# EAGLE design mojoafe (EAGLE 6.4)
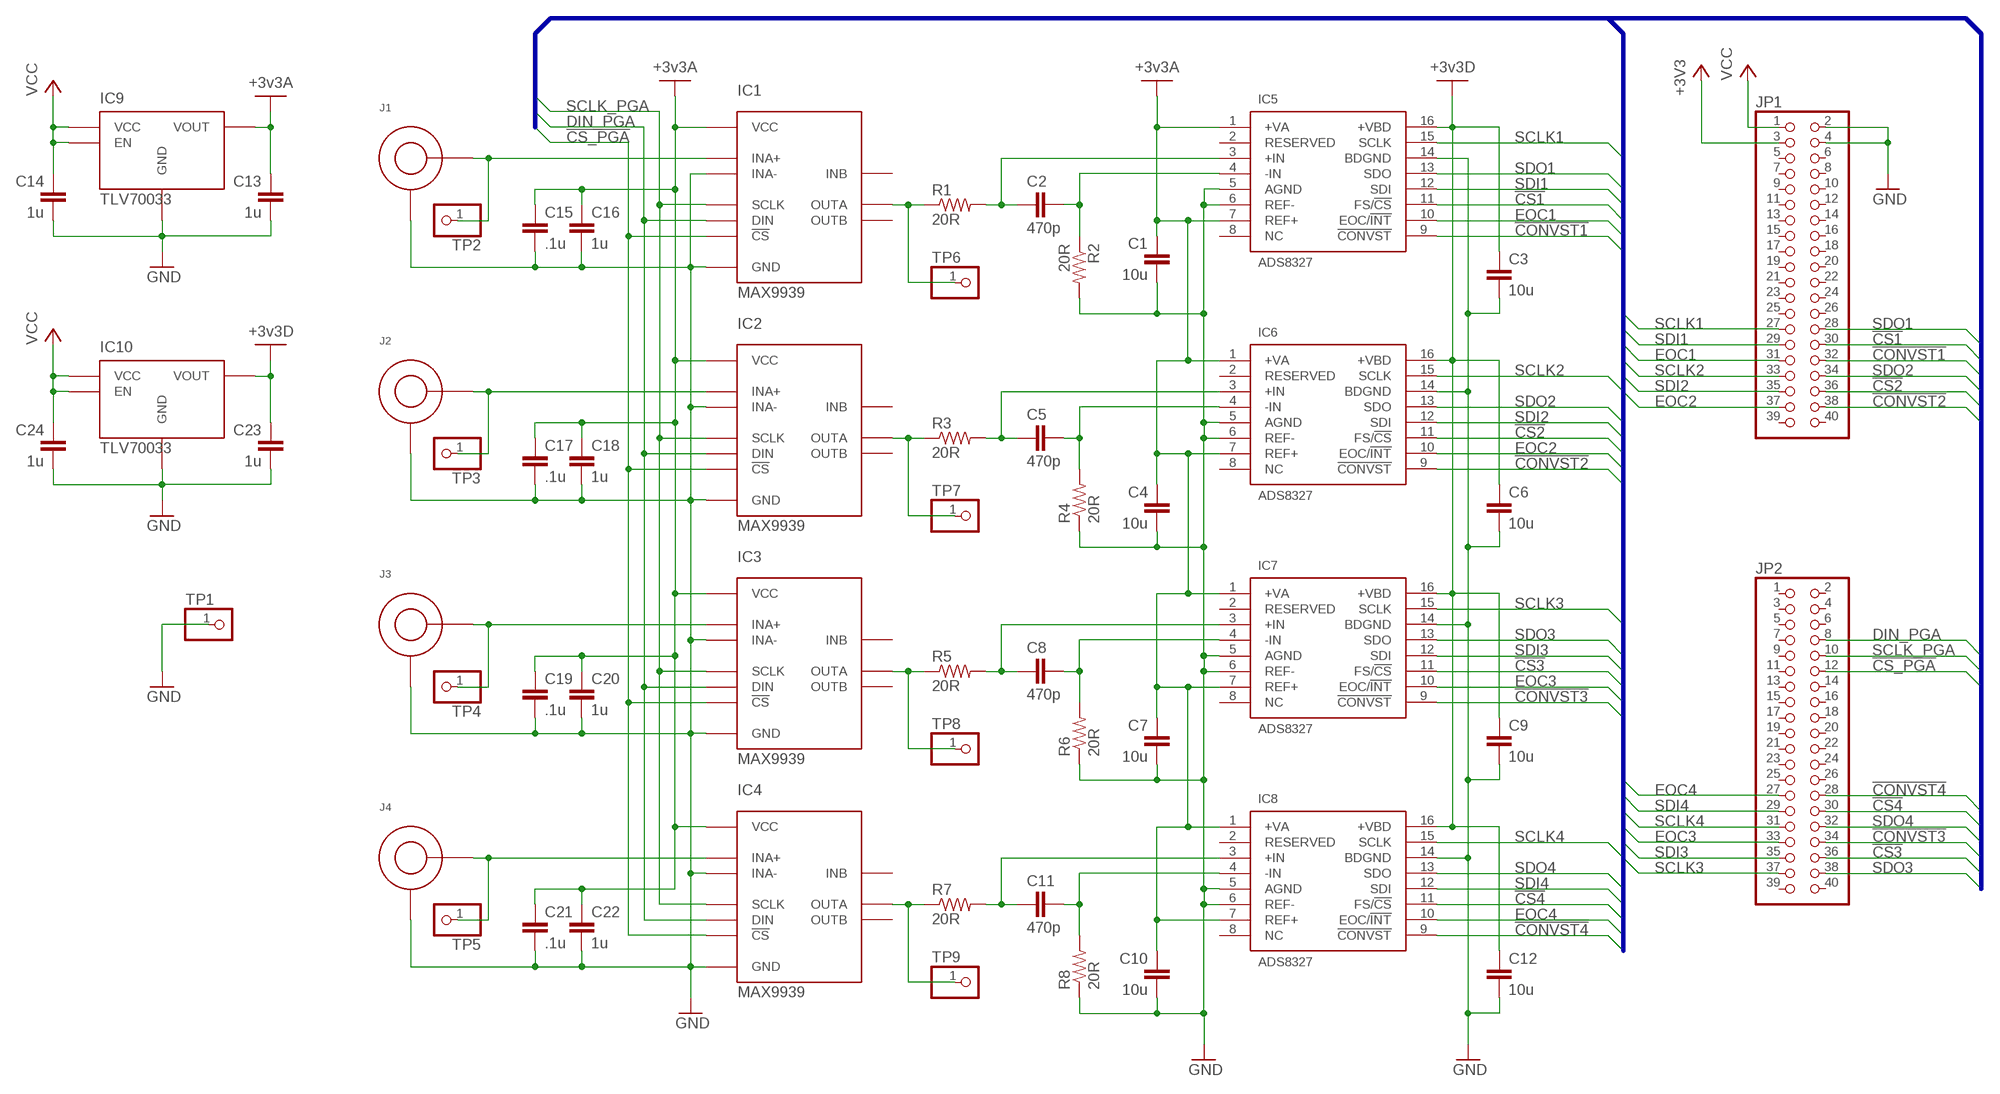
[diagram p0: schematic, sheet 1]

## Parts
C1  10u  C-EUC0603K  [C0603K]
C2  470p  C-EUC0603K  [C0603K]
C3  10u  C-EUC0603K  [C0603K]
C4  10u  C-EUC0603K  [C0603K]
C5  470p  C-EUC0603K  [C0603K]
C6  10u  C-EUC0603K  [C0603K]
C7  10u  C-EUC0603K  [C0603K]
C8  470p  C-EUC0603K  [C0603K]
C9  10u  C-EUC0603K  [C0603K]
C10  10u  C-EUC0603K  [C0603K]
C11  470p  C-EUC0603K  [C0603K]
C12  10u  C-EUC0603K  [C0603K]
C13  1u  C-EUC0603K  [C0603K]
C14  1u  C-EUC0603K  [C0603K]
C15  .1u  C-EUC0603K  [C0603K]
C16  1u  C-EUC0603K  [C0603K]
C17  .1u  C-EUC0603K  [C0603K]
C18  1u  C-EUC0603K  [C0603K]
C19  .1u  C-EUC0603K  [C0603K]
C20  1u  C-EUC0603K  [C0603K]
C21  .1u  C-EUC0603K  [C0603K]
C22  1u  C-EUC0603K  [C0603K]
C23  1u  C-EUC0603K  [C0603K]
C24  1u  C-EUC0603K  [C0603K]
IC1  MAX9939  [UMAX10]
IC2  MAX9939  [UMAX10]
IC3  MAX9939  [UMAX10]
IC4  MAX9939  [UMAX10]
IC5  ADS8327  [TSSOP16]
IC6  ADS8327  [TSSOP16]
IC7  ADS8327  [TSSOP16]
IC8  ADS8327  [TSSOP16]
IC9  TLV70033  [SOT5]
IC10  TLV70033  [SOT5]
J1  SMB50R  [SMB50R]
J2  SMB50R  [SMB50R]
J3  SMB50R  [SMB50R]
J4  SMB50R  [SMB50R]
JP1  PINHD-2X20  [2X20]
JP2  PINHD-2X20  [2X20]
R1  20R  R-US_R0603  [R0603]
R2  20R  R-US_R0603  [R0603]
R3  20R  R-US_R0603  [R0603]
R4  20R  R-US_R0603  [R0603]
R5  20R  R-US_R0603  [R0603]
R6  20R  R-US_R0603  [R0603]
R7  20R  R-US_R0603  [R0603]
R8  20R  R-US_R0603  [R0603]
TP1  PINHD-1X1  [1X01]
TP2  PINHD-1X1  [1X01]
TP3  PINHD-1X1  [1X01]
TP4  PINHD-1X1  [1X01]
TP5  PINHD-1X1  [1X01]
TP6  PINHD-1X1  [1X01]
TP7  PINHD-1X1  [1X01]
TP8  PINHD-1X1  [1X01]
TP9  PINHD-1X1  [1X01]

## Nets
!CONVST1: IC5.9(!CONVST) JP1.32
!CONVST2: IC6.9(!CONVST) JP1.38
!CONVST3: IC7.9(!CONVST) JP2.34
!CONVST4: IC8.9(!CONVST) JP2.28
!CS1: IC5.11(FS/!CS) JP1.30
!CS2: IC6.11(FS/!CS) JP1.36
!CS3: IC7.11(FS/!CS) JP2.36
!CS4: IC8.11(FS/!CS) JP2.30
!CS_PGA: IC1.10(!CS) IC2.10(!CS) IC3.10(!CS) IC4.10(!CS) JP2.12
+3V3: JP1.3
+3V3A: C1.1 C4.1 C7.1 C10.1 C13.1 C15.1 C16.1 C17.1 C18.1 C19.1 C20.1 C21.1 C22.1 IC1.9(VCC) IC2.9(VCC) IC3.9(VCC) IC4.9(VCC) IC5.1(+VA) IC5.7(REF+) IC6.1(+VA) IC6.7(REF+) IC7.1(+VA) IC7.7(REF+) IC8.1(+VA) IC8.7(REF+) IC9.5(VOUT)
+3V3D: C3.1 C6.1 C9.1 C12.1 C23.1 IC5.16(+VBD) IC6.16(+VBD) IC7.16(+VBD) IC8.16(+VBD) IC10.5(VOUT)
DIN_PGA: IC1.2(DIN) IC2.2(DIN) IC3.2(DIN) IC4.2(DIN) JP2.8
EOC1: IC5.10(EOC/!INT) JP1.31
EOC2: IC6.10(EOC/!INT) JP1.37
EOC3: IC7.10(EOC/!INT) JP2.33
EOC4: IC8.10(EOC/!INT) JP2.27
GND: C1.2 C3.2 C4.2 C6.2 C7.2 C9.2 C10.2 C12.2 C13.2 C14.2 C15.2 C16.2 C17.2 C18.2 C19.2 C20.2 C21.2 C22.2 C23.2 C24.2 IC1.3(GND) IC1.4(INA-) IC2.3(GND) IC2.4(INA-) IC3.3(GND) IC3.4(INA-) IC4.3(GND) IC4.4(INA-) IC5.5(AGND) IC5.6(REF-) IC5.14(BDGND) IC6.5(AGND) IC6.6(REF-) IC6.14(BDGND) IC7.5(AGND) IC7.6(REF-) IC7.14(BDGND) IC8.5(AGND) IC8.6(REF-) IC8.14(BDGND) IC9.2(GND) IC10.2(GND) J1.P$1 J1.P$2 J1.P$3 J1.P$4 J2.P$1 J2.P$2 J2.P$3 J2.P$4 J3.P$1 J3.P$2 J3.P$3 J3.P$4 J4.P$1 J4.P$2 J4.P$3 J4.P$4 JP1.2 JP1.4 R2.2 R4.1 R6.1 R8.1 TP1.1
N$1: IC1.5(INA+) J1.P$5 TP2.1
N$2: IC3.8(OUTA) R5.1 TP8.1
N$3: C8.2 IC7.4(-IN) R6.2
N$4: IC2.5(INA+) J2.P$5 TP3.1
N$5: IC3.5(INA+) J3.P$5 TP4.1
N$6: IC4.8(OUTA) R7.1 TP9.1
N$8: IC1.8(OUTA) R1.1 TP6.1
N$9: IC2.8(OUTA) R3.1 TP7.1
N$10: C5.1 IC6.3(+IN) R3.2
N$12: C2.1 IC5.3(+IN) R1.2
N$13: C5.2 IC6.4(-IN) R4.2
N$14: C2.2 IC5.4(-IN) R2.1
N$15: C8.1 IC7.3(+IN) R5.2
N$16: IC4.5(INA+) J4.P$5 TP5.1
N$19: C11.1 IC8.3(+IN) R7.2
N$22: C11.2 IC8.4(-IN) R8.2
SCLK1: IC5.15(SCLK) JP1.27
SCLK2: IC6.15(SCLK) JP1.33
SCLK3: IC7.15(SCLK) JP2.37
SCLK4: IC8.15(SCLK) JP2.31
SCLK_PGA: IC1.1(SCLK) IC2.1(SCLK) IC3.1(SCLK) IC4.1(SCLK) JP2.10
SDI1: IC5.12(SDI) JP1.29
SDI2: IC6.12(SDI) JP1.35
SDI3: IC7.12(SDI) JP2.35
SDI4: IC8.12(SDI) JP2.29
SDO1: IC5.13(SDO) JP1.28
SDO2: IC6.13(SDO) JP1.34
SDO3: IC7.13(SDO) JP2.38
SDO4: IC8.13(SDO) JP2.32
VCC: C14.1 C24.1 IC9.1(VCC) IC9.3(EN) IC10.1(VCC) IC10.3(EN) JP1.1
Unconnected: IC1.6(OUTB) IC1.7(INB) IC2.6(OUTB) IC2.7(INB) IC3.6(OUTB) IC3.7(INB) IC4.6(OUTB) IC4.7(INB) IC5.2(RESERVED) IC5.8(NC) IC6.2(RESERVED) IC6.8(NC) IC7.2(RESERVED) IC7.8(NC) IC8.2(RESERVED) IC8.8(NC) JP1.5 JP1.6 JP1.7 JP1.8 JP1.9 JP1.10 JP1.11 JP1.12 JP1.13 JP1.14 JP1.15 JP1.16 JP1.17 JP1.18 JP1.19 JP1.20 JP1.21 JP1.22 JP1.23 JP1.24 JP1.25 JP1.26 JP1.39 JP1.40 JP2.1 JP2.2 JP2.3 JP2.4 JP2.5 JP2.6 JP2.7 JP2.9 JP2.11 JP2.13 JP2.14 JP2.15 JP2.16 JP2.17 JP2.18 JP2.19 JP2.20 JP2.21 JP2.22 JP2.23 JP2.24 JP2.25 JP2.26 JP2.39 JP2.40

## Buses
SCLK[1..4],SDO[1..4],SDI[1..4],!CS[1..4],EOC[1..4],!CONVST[1..4],!CS_PGA,DIN_PGA,SCLK_PGA

## Library data of the parts
C1-C24 = resistor:C-EU: CAPACITOR, European symbol
IC1-IC4 = custom:MAX9939
IC5-IC8 = custom:ADS8327
IC9 IC10 = custom:TLV70033
J1-J4 = custom:SMB50R
JP1 JP2 = pinhead:PINHD-2X20: PIN HEADER
R1-R8 = resistor:R-US_: RESISTOR, American symbol
TP1-TP9 = pinhead:PINHD-1X1: PIN HEADER

## Board
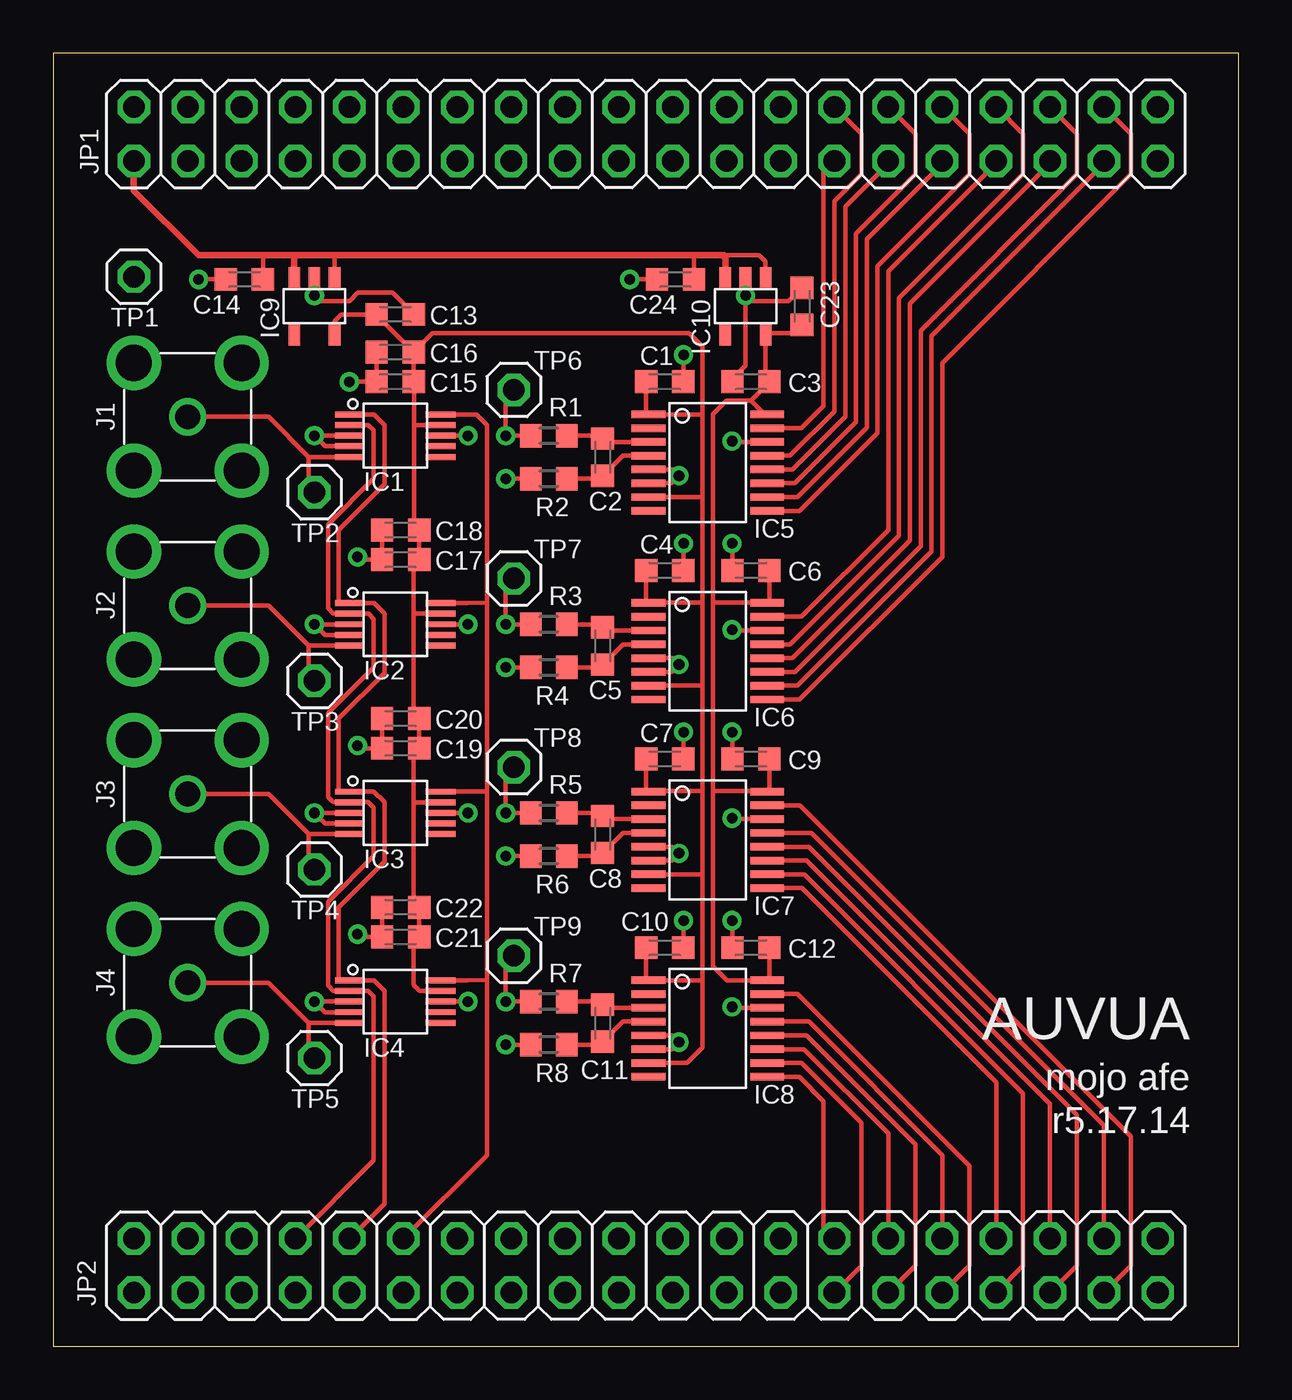
[diagram p1: board, top side]
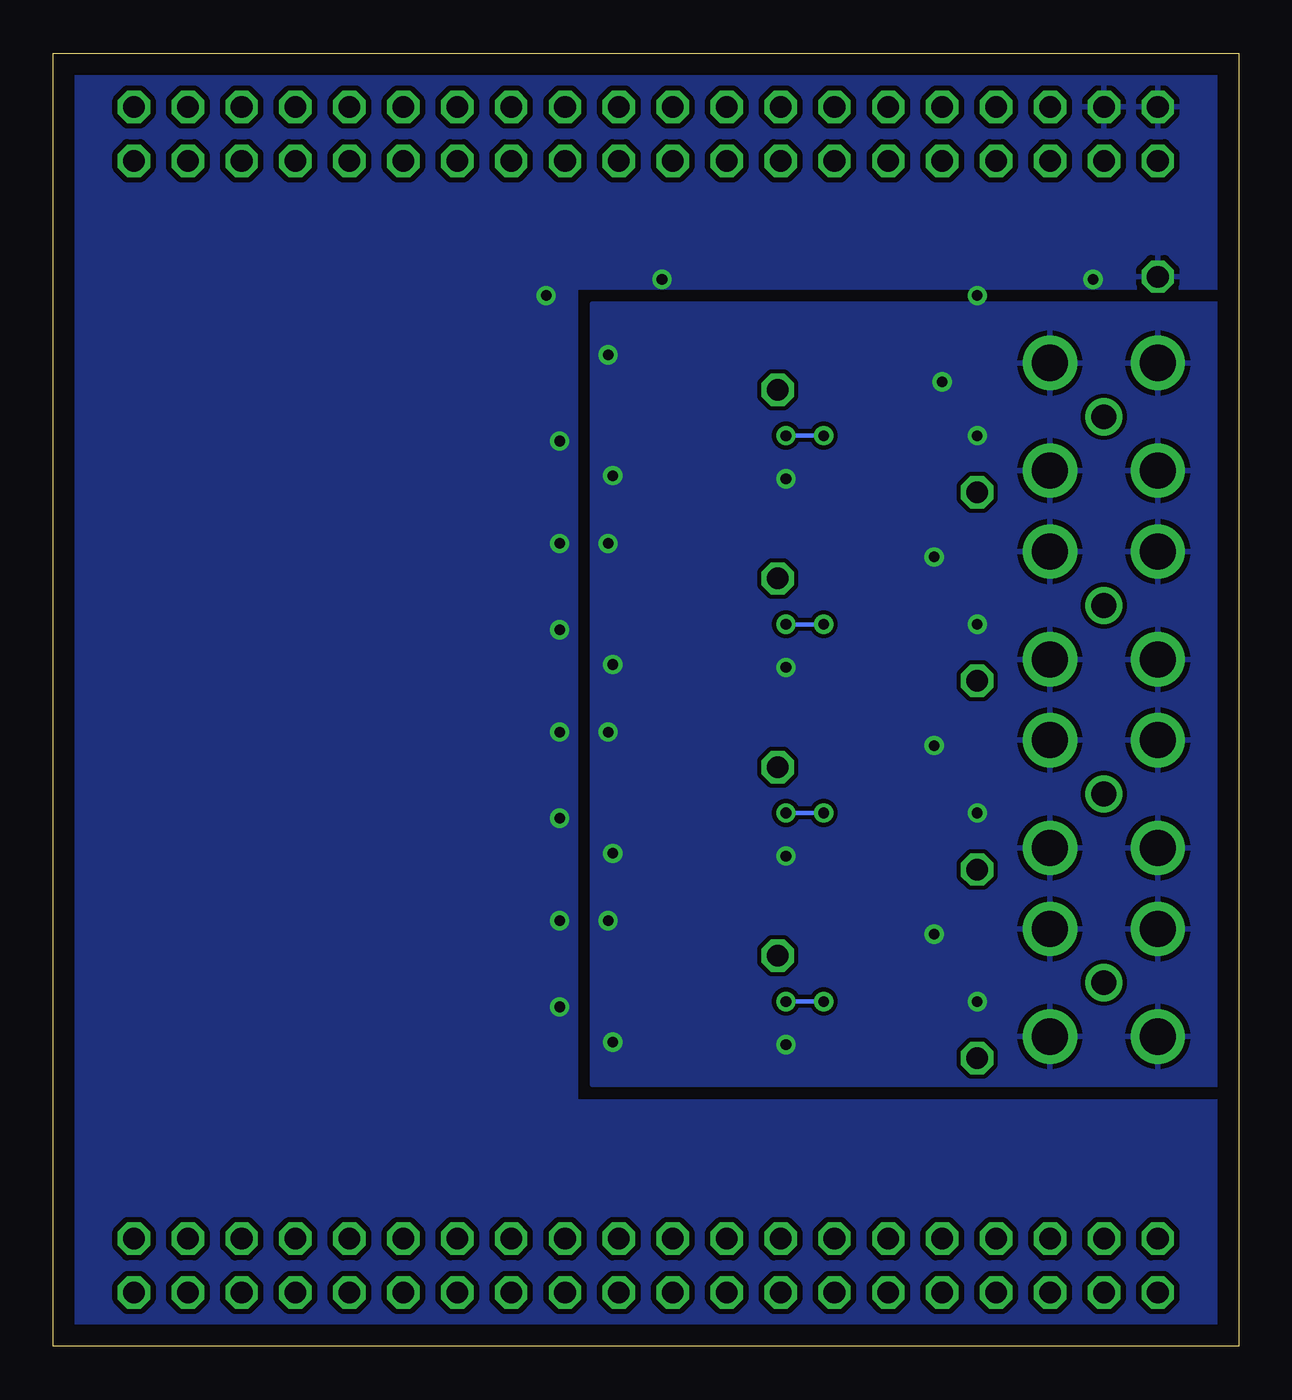
[diagram p2: board, bottom side, seen from below]

Size 55.88 x 60.96 mm. Coordinates in mm from the lower left corner, seen from the top.
Outline: 0,0 55.88,0 55.88,60.96 0,60.96 0,0
Copper layers (1*16): Top 0.035mm / dielectric 1.5mm / Bottom 0.035mm
Design rules "default": minimum track width 10mil, minimum drill 24mil, track to track 8mil, track to pad 8mil, pad to pad 8mil, via to via 8mil, smd to smd 8mil, copper to edge 40mil, drill to drill 8mil, minimum pad ring 10mil, minimum via ring 8mil, stop-mask expansion 4mil, vias tented up to drill 0mil, thermal gap 10mil

### Footprints (pad centres in the part's own frame; a part is rotated, then mirrored left to right if it is on the bottom)
C0603K = smd 1.05 x 1.08: 1 -0.875,0; 2 0.875,0
UMAX10 = smd 1.4 x 0.28: 1 -2.14,1; 2 -2.14,0.5; 3 -2.14,0; 4 -2.14,-0.5; 5 -2.14,-1; 6 2.14,-1; 7 2.14,-0.5; 8 2.14,0; 9 2.14,0.5; 10 2.14,1
TSSOP16 = smd 1.6 x 0.35: 1 -2.8,2.275; 2 -2.8,1.625; 3 -2.8,0.975; 4 -2.8,0.325; 5 -2.8,-0.325; 6 -2.8,-0.975; 7 -2.8,-1.625; 8 -2.8,-2.275; 9 2.8,-2.275; 10 2.8,-1.625; 11 2.8,-0.975; 12 2.8,-0.325; 13 2.8,0.325; 14 2.8,0.975; 15 2.8,1.625; 16 2.8,2.275
SOT5 = smd 0.55 x 1: 1 -0.95,-1.35; 2 0,-1.35; 3 0.95,-1.35; 4 0.95,1.35; 5 -0.95,1.35
SMB50R = drill 1.702: P$1 -2.54,2.54; P$2 -2.54,-2.54; P$3 2.54,-2.54; P$4 2.54,2.54 | drill 1.168: P$5 0,0
2X20 = drill 1.016 octagon: 1 -24.13,-1.27; 2 -24.13,1.27; 3 -21.59,-1.27; 4 -21.59,1.27; 5 -19.05,-1.27; 6 -19.05,1.27; 7 -16.51,-1.27; 8 -16.51,1.27; 9 -13.97,-1.27; 10 -13.97,1.27; 11 -11.43,-1.27; 12 -11.43,1.27; 13 -8.89,-1.27; 14 -8.89,1.27; 15 -6.35,-1.27; 16 -6.35,1.27; 17 -3.81,-1.27; 18 -3.81,1.27; 19 -1.27,-1.27; 20 -1.27,1.27; 21 1.27,-1.27; 22 1.27,1.27; 23 3.81,-1.27; 24 3.81,1.27; 25 6.35,-1.27; 26 6.35,1.27; 27 8.89,-1.27; 28 8.89,1.27; 29 11.43,-1.27; 30 11.43,1.27; 31 13.97,-1.27; 32 13.97,1.27; 33 16.51,-1.27; 34 16.51,1.27; 35 19.05,-1.27; 36 19.05,1.27; 37 21.59,-1.27; 38 21.59,1.27; 39 24.13,-1.27; 40 24.13,1.27
R0603 = smd 1 x 1.1: 1 -0.85,0; 2 0.85,0
1X01 = drill 1.016 octagon: 1 0,0

### Placement (x,y rotation side)
C1  28.83,45.47 0 top
C2  25.91,41.91 270 top
C3  32.89,45.47 180 top
C4  28.83,36.58 0 top
C5  25.91,33.02 270 top
C6  32.89,36.58 180 top
C7  28.83,27.69 0 top
C8  25.91,24.13 270 top
C9  32.89,27.69 180 top
C10  28.83,18.8 0 top
C11  25.91,15.24 270 top
C12  32.89,18.8 180 top
C13  16.13,48.64 0 top
C14  9.02,50.29 180 top
C15  16.13,45.47 180 top
C16  16.13,46.86 180 top
C17  16.38,37.08 180 top
C18  16.38,38.48 180 top
C19  16.38,28.19 180 top
C20  16.38,29.59 180 top
C21  16.38,19.3 180 top
C22  16.38,20.7 180 top
C23  35.31,49.02 90 top
C24  29.34,50.29 180 top
IC1  16.13,42.93 0 top
IC2  16.13,34.04 0 top
IC3  16.13,25.15 0 top
IC4  16.13,16.26 0 top
IC5  30.86,41.66 0 top
IC6  30.86,32.77 0 top
IC7  30.86,23.88 0 top
IC8  30.86,14.99 0 top
IC9  12.32,49.02 180 top
IC10  32.64,49.02 180 top
J1  6.35,43.81 0 top
J2  6.35,34.92 0 top
J3  6.35,26.04 0 top
J4  6.35,17.14 0 top
JP1  27.94,57.15 0 top
JP2  27.94,3.81 0 top
R1  23.37,42.93 0 top
R2  23.37,40.89 180 top
R3  23.37,34.04 0 top
R4  23.37,32 0 top
R5  23.37,25.15 0 top
R6  23.37,23.11 0 top
R7  23.37,16.26 0 top
R8  23.37,14.22 0 top
TP1  3.81,50.42 0 top
TP2  12.32,40.26 0 top
TP3  12.32,31.37 0 top
TP4  12.32,22.48 0 top
TP5  12.32,13.59 0 top
TP6  21.72,45.09 0 top
TP7  21.72,36.2 0 top
TP8  21.72,27.3 0 top
TP9  21.72,18.41 0 top

### Tracks (layer width: path | path; a pad name or v marks a point on that pad's centre or on a via)
!CONVST1
  Top 0.203: IC5.9 35.19,39.38 38.86,43.05 38.86,50.93 43.18,55.24 43.18,57.15 JP1.32
!CONVST2
  Top 0.203: IC6.9 35.19,30.49 41.91,37.21 41.91,46.35 50.8,55.24 50.8,57.15 JP1.38
!CONVST3
  Top 0.203: IC7.9 35.3,21.6 44.45,12.45 JP2.34
!CONVST4
  Top 0.203: IC8.9 35.17,12.71 36.32,11.56 36.32,5.59 JP2.28
!CS1
  Top 0.203: IC5.11 34.97,40.68 37.85,43.56 37.85,52.45 40.64,55.24 40.64,57.15 JP1.30
!CS2
  Top 0.203: IC6.11 34.97,31.79 40.89,37.72 40.89,47.88 48.26,55.24 48.26,57.15 JP1.36
!CS3
  Top 0.203: IC7.11 35.52,22.9 46.99,11.43 JP2.36
!CS4
  Top 0.203: IC8.11 35.39,14.01 39.37,10.03 JP2.30
!CS_PGA
  Top 0.203: IC1.10 19.95,43.93 20.45,43.43 20.45,35.05 | 20.45,35.05 20.45,26.16 | 20.45,26.16 20.45,17.27 | 20.45,17.27 20.45,9.02 JP2.12 | IC2.10 19.54,35.04 20.45,35.05 | IC3.10 19.54,26.15 20.45,26.16 | IC4.10 19.54,17.26 20.45,17.27
+3V3A
  Top 0.203: C16.1 C15.1 17.02,45.47 17.02,43.43 | C18.1 C17.1 17,36.83 17,34.54 | IC4.9 17.28,16.76 17,17.03 17,19.05 C21.1 C22.1 17,20.95 17,25.65 | 17.27,38.49 C18.1 | IC3.9 17.01,25.65 17,25.65 | IC2.9 17.01,34.54 17,34.54 | IC1.9 17.03,43.43 17.02,43.43 | 28.08,43.95 IC5.1 | IC8.7 29.87,13.36 30.61,14.1 30.61,17.27 | 30.61,17.27 30.61,22.23 | 30.61,22.23 30.61,26.16 | 30.61,26.16 30.61,31.11 | 30.61,31.11 30.61,35.05 | 30.61,35.05 30.61,40.01 | 30.61,40.01 30.61,43.94 | IC5.1 30.6,43.93 30.61,43.94 | 30.61,35.05 30.6,35.06 28.08,35.06 IC6.1 27.95,35.15 C4.1 | 30.61,26.16 30.6,26.17 28.08,26.17 IC7.1 27.95,26.26 C7.1 | 30.61,17.27 30.6,17.26 IC8.1 27.95,17.37 C10.1 | C1.1 27.95,44.04 IC5.1 | IC7.7 30.58,22.25 30.61,22.23 | IC6.7 30.58,31.14 30.61,31.11 | IC5.7 30.58,40.03 30.61,40.01 | IC9.5 13.27,48.32 13.59,48.64 C13.1 15.25,48.61 C16.1 | 30.61,43.94 30.61,47.12 29.97,47.75 17.89,47.75 C16.1 | 17,34.54 17,29.84 C20.1 C19.1 17,27.94 17,25.65 | 17.02,43.43 17.02,38.72 C18.1
+3V3D
  Top 0.203: IC5.16 33.64,43.95 33.52,43.95 32.89,44.58 | 33.64,17.28 IC8.16 | 32.89,44.58 33.77,45.45 C3.1 33.59,45.65 IC10.5 33.67,47.75 34.92,47.75 35.31,48.13 C23.1 | 32.89,44.58 31.75,44.58 31.11,43.94 31.11,35.05 | 31.11,35.05 31.11,26.16 | 31.11,26.16 31.11,17.91 31.76,17.26 IC8.16 | C12.1 33.77,17.37 IC8.16 | 31.11,26.16 31.12,26.17 33.64,26.17 IC7.16 33.77,26.26 C9.1 | 31.11,35.05 31.12,35.06 33.64,35.06 IC6.16 33.77,35.15 C6.1
DIN_PGA
  Top 0.203: IC1.2 14.85,43.43 14.86,43.43 15.11,43.18 15.11,40.89 12.95,38.73 12.95,34.8 13.21,34.54 IC2.2 14.87,34.54 15.11,34.29 15.11,32 12.95,29.84 12.95,25.91 13.21,25.65 IC3.2 | IC3.2 | IC3.2 14.86,25.65 15.11,25.4 15.11,23.11 12.95,20.95 12.95,17.02 13.21,16.76 IC4.2 | IC4.2 | IC4.2 14.86,16.76 15.11,16.51 15.11,8.76 JP2.8
EOC1
  Top 0.203: IC5.10 35.08,40.03 38.35,43.31 38.35,52.2 41.53,55.37 41.53,55.5 JP1.31
EOC2
  Top 0.203: IC6.10 35.08,31.14 41.4,37.47 41.4,47.62 49.15,55.37 49.15,55.5 JP1.37
EOC3
  Top 0.203: IC7.10 35.41,22.25 45.72,11.94 45.72,3.81 JP2.33
EOC4
  Top 0.203: IC8.10 35.28,13.36 38.1,10.54 38.1,3.81 JP2.27
GND  (via drill 0.5)
  Top 0.203: C16.2 C15.2 v13.97,45.47 | v14.35,37.21 14.48,37.08 C17.2 C18.2 | v14.35,28.32 14.48,28.19 C19.2 C20.2 | v14.35,19.43 14.48,19.3 C21.2 C22.2 | IC1.4 12.82,42.43 v12.32,42.93 IC1.3 | IC2.3 v12.32,34.04 12.82,33.54 IC2.4 | IC3.3 v12.32,25.15 12.82,24.65 IC3.4 | IC4.3 v12.32,16.26 12.82,15.76 IC4.4 | R2.2 v21.34,40.89 | R4.1 v21.34,32 | R6.1 v21.34,23.11 | R8.1 v21.34,14.22 | IC8.6 29.17,14.01 v29.5,14.34 29.18,14.66 IC8.5 | IC7.6 29.16,22.9 v29.5,23.24 29.19,23.55 IC7.5 | IC6.6 29.15,31.79 v29.5,32.14 29.2,32.44 IC6.5 | IC5.6 29.14,40.68 v29.5,41.04 29.21,41.33 IC5.5 | C1.2 29.7,46.72 v29.72,46.74 | C4.2 29.7,37.83 v29.72,37.85 | C7.2 29.7,28.94 v29.72,28.96 | C10.2 29.7,20.05 v29.72,20.07 | IC9.2 v12.32,49.53 12.57,49.28 13.97,49.28 14.35,49.66 16,49.66 17,48.66 C13.2 | IC10.2 v32.64,49.53 | C14.2 v6.86,50.29 | C23.2 35.29,49.9 34.67,49.28 32.89,49.28 v32.64,49.53 | C24.2 v27.18,50.29 | C3.2 32.02,45.61 32.64,46.23 v32.64,49.53 | IC8.14 32.05,15.96 v32,16 | IC7.14 32.05,24.85 v32,24.89 | IC6.14 32.05,33.74 v32,33.78 | IC5.14 32.05,42.63 v32,42.67 | C6.2 32.02,37.83 v32,37.85 | C9.2 32.02,28.94 v32,28.96 | C12.2 32.02,20.05 v32,20.07
  pour Bottom (isolate 0.254): -0.25,61.21 56.13,61.21 56.13,-0.38 -0.25,-0.38 -0.25,11.56 31.24,11.56 31.24,49.91 -0.25,49.91
  pour Bottom: -1.14,49.15 30.48,49.15 30.48,12.32 -1.14,12.32
N$1
  Top 0.203: J1.P$5 10.16,43.81 12.05,41.93 | 12.05,41.93 IC1.5 | TP2.1 12.05,40.53 12.05,41.93
N$2  (via drill 0.5)
  Top 0.203: IC3.8 v19.56,25.15 | R5.1 v21.34,25.15 21.34,26.92 TP8.1
  Bottom 0.203: v19.56,25.15 v21.34,25.15
N$3
  Top 0.203: R6.2 25.77,23.11 C8.2 26.85,24.2 IC7.4
N$4
  Top 0.203: J2.P$5 10.16,34.92 12.05,33.04 | 12.05,33.04 IC2.5 | TP3.1 12.05,31.64 12.05,33.04
N$5
  Top 0.203: J3.P$5 10.16,26.04 12.05,24.15 | 12.05,24.15 IC3.5 | TP4.1 12.05,22.75 12.05,24.15
N$6  (via drill 0.5)
  Top 0.203: IC4.8 v19.56,16.26 | R7.1 v21.34,16.26 21.34,18.03 TP9.1
  Bottom 0.203: v19.56,16.26 v21.34,16.26
N$8  (via drill 0.5)
  Top 0.203: IC1.8 v19.56,42.93 | R1.1 v21.34,42.93 21.34,44.7 TP6.1
  Bottom 0.203: v19.56,42.93 v21.34,42.93
N$9  (via drill 0.5)
  Top 0.203: IC2.8 v19.56,34.04 | R3.1 v21.34,34.04 21.34,35.81 TP7.1
  Bottom 0.203: v19.56,34.04 v21.34,34.04
N$10
  Top 0.203: IC6.3 26.06,33.74 C5.1 25.77,34.04 R3.2
N$12
  Top 0.203: R1.2 25.77,42.93 C2.1 26.06,42.63 IC5.3
N$13
  Top 0.203: R4.2 25.77,32 C5.2 26.85,33.09 IC6.4
N$14
  Top 0.203: R2.1 25.77,40.89 C2.2 26.85,41.98 IC5.4
N$15
  Top 0.203: IC7.3 26.06,24.85 C8.1 25.77,25.15 R5.2
N$16
  Top 0.203: J4.P$5 10.16,17.14 12.05,15.26 | 12.05,15.26 IC4.5 | TP5.1 12.05,13.86 12.05,15.26
N$19
  Top 0.203: IC8.3 26.06,15.96 C11.1 25.77,16.26 R7.2
N$22
  Top 0.203: R8.2 25.77,14.22 C11.2 26.85,15.31 IC8.4
SCLK1
  Top 0.203: IC5.15 35.28,43.28 36.32,44.32 36.32,55.37 JP1.27
SCLK2
  Top 0.203: IC6.15 35.28,34.39 39.37,38.48 39.37,50.67 43.94,55.24 43.94,55.37 JP1.33
SCLK3
  Top 0.203: IC7.15 35.2,25.5 50.8,9.91 50.8,3.81 JP2.37
SCLK4
  Top 0.203: IC8.15 35.08,16.61 43.18,8.51 43.18,3.81 JP2.31
SCLK_PGA
  Top 0.203: IC1.1 15.13,43.93 15.62,43.43 15.62,40.64 13.46,38.48 13.46,35.05 13.97,35.05 IC2.1 15.13,35.04 15.62,34.54 15.62,31.75 13.46,29.59 13.46,26.16 13.97,26.16 | 13.97,26.16 IC3.1 | 13.97,26.16 15.11,26.16 15.62,25.65 15.62,22.86 13.46,20.7 13.46,17.27 13.97,17.27 IC4.1 15.13,17.26 15.62,16.76 15.62,6.73 JP2.10
SDI1
  Top 0.203: IC5.12 34.85,41.33 37.34,43.81 37.34,53.72 38.99,55.37 38.99,55.5 JP1.29
SDI2
  Top 0.203: IC6.12 34.85,32.44 40.39,37.97 40.39,49.15 46.61,55.37 46.61,55.5 JP1.35
SDI3
  Top 0.203: IC7.12 35.63,23.55 48.26,10.92 48.26,3.81 JP2.35
SDI4
  Top 0.203: IC8.12 35.5,14.66 40.64,9.53 40.64,3.81 JP2.29
SDO1
  Top 0.203: IC5.13 34.74,41.98 36.83,44.07 36.83,53.98 38.1,55.24 38.1,57.15 JP1.28
SDO2
  Top 0.203: IC6.13 34.74,33.09 39.88,38.23 39.88,49.4 45.72,55.24 45.72,57.15 JP1.34
SDO3
  Top 0.203: IC7.13 35.74,24.2 49.53,10.41 JP2.38
SDO4
  Top 0.203: IC8.13 35.62,15.31 41.91,9.02 JP2.32
VCC
  Top 0.203: 31.62,51.44 33.27,51.44 33.59,51.12 IC10.1 | 13.21,51.44 13.27,51.37 IC9.1 | 11.34,50.41 IC9.3 | C14.1 9.89,51.32 9.78,51.44 | C24.1 30.21,51.42 30.23,51.44
  Top 0.305: 3.81,55.63 JP1.1 3.81,54.48 6.86,51.44 9.78,51.44 11.3,51.44 | 30.23,51.44 31.62,51.44 31.69,51.25 IC10.3 | IC9.3 11.37,51.37 11.3,51.44 | 30.21,51.42 30.2,51.44 13.21,51.44 11.3,51.44

### Text on the board
tPlace: AUVUA | mojo afe | r5.17.14